# EAGLE design back (EAGLE 6.5.0)
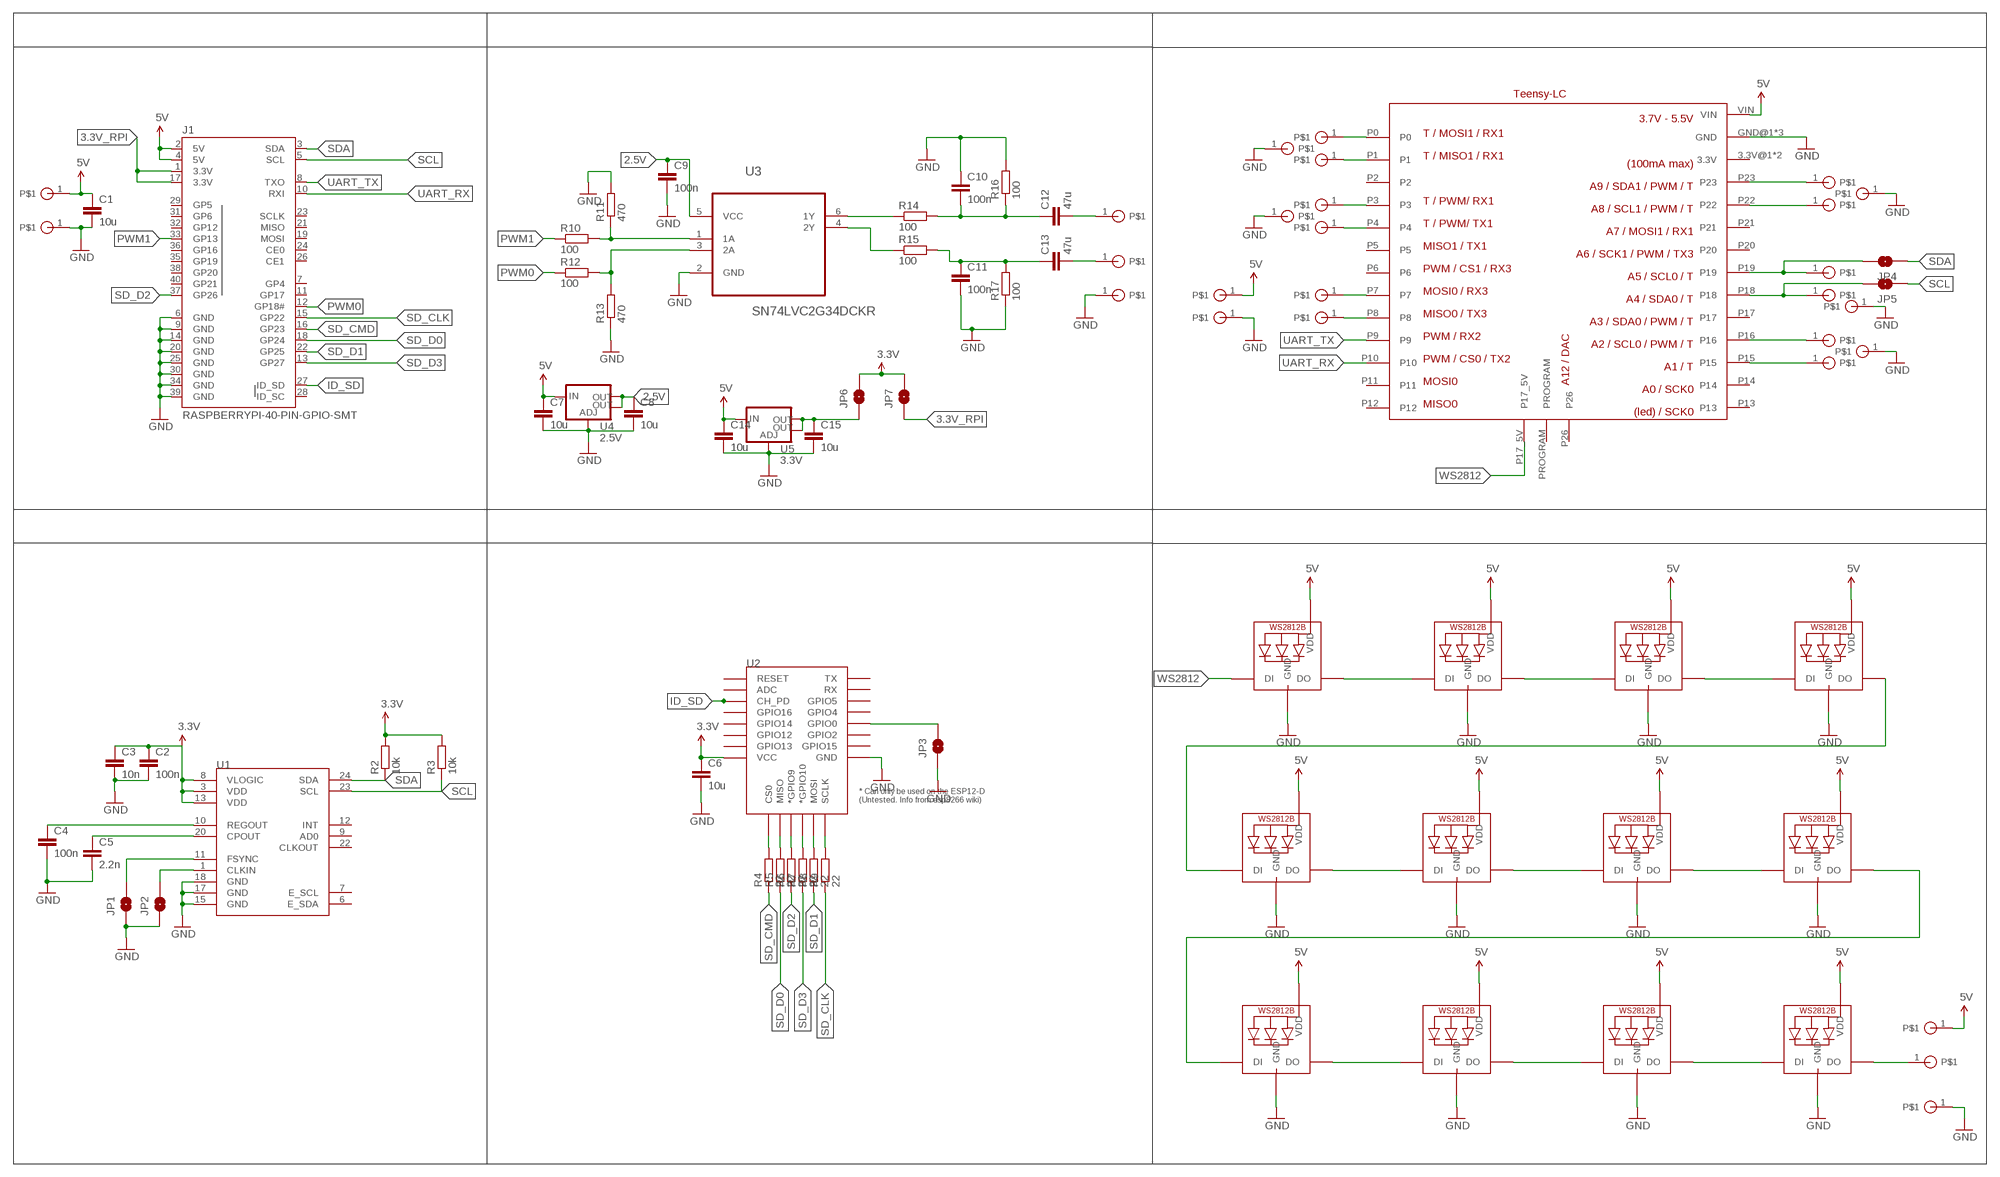
[diagram p0: schematic, sheet 1]

## Parts
5V_FRONT  SOLDER_PAD  [SOLDER_PAD]
5V_POWER  SOLDER_PAD  [SOLDER_PAD]
5V_WS1282  SOLDER_PAD  [SOLDER_PAD]
AUDIO_GND  SOLDER_PAD  [SOLDER_PAD]
AUDIO_L  SOLDER_PAD  [SOLDER_PAD]
AUDIO_R  SOLDER_PAD  [SOLDER_PAD]
C1  10u  C-EUC0805  [C0805]
C2  100n  C-EUC0603  [C0603]
C3  10n  C-EUC0603  [C0603]
C4  100n  C-EUC0603  [C0603]
C5  2.2n  C-EUC0603  [C0603]
C6  10u  C-EUC0805  [C0805]
C7  10u  C-EUC0805  [C0805]
C8  10u  C-EUC0805  [C0805]
C9  100n  C-EUC0603  [C0603]
C10  100n  C-EUC0603  [C0603]
C11  100n  C-EUC0603  [C0603]
C12  47u  C-EUC0805  [C0805]
C13  47u  C-EUC0805  [C0805]
C14  10u  C-EUC0805  [C0805]
C15  10u  C-EUC0805  [C0805]
DO_WS1282  SOLDER_PAD  [SOLDER_PAD]
GND_FRONT  SOLDER_PAD  [SOLDER_PAD]
GND_POWER  SOLDER_PAD  [SOLDER_PAD]
GND_T1_T2  SOLDER_PAD  [SOLDER_PAD]
GND_T3_T4  SOLDER_PAD  [SOLDER_PAD]
GND_T5_T6  SOLDER_PAD  [SOLDER_PAD]
GND_T7_T8  SOLDER_PAD  [SOLDER_PAD]
GND_T_SPARE  SOLDER_PAD  [SOLDER_PAD]
GND_WS2812  SOLDER_PAD  [SOLDER_PAD]
J1  RASPBERRYPI-40-PIN-GPIO-SMT  [2X20-SHROUDED-SMT]
JP1  JUMPER-PAD-2-NOYES_SILK  [PAD-JUMPER-2-NO_YES_SILK]
JP2  JUMPER-PAD-2-NOYES_SILK  [PAD-JUMPER-2-NO_YES_SILK]
JP3  JUMPER-PAD-2-NOYES_SILK  [PAD-JUMPER-2-NO_YES_SILK]
JP4  JUMPER-PAD-2-NOYES_SILK  [PAD-JUMPER-2-NO_YES_SILK]
JP5  JUMPER-PAD-2-NOYES_SILK  [PAD-JUMPER-2-NO_YES_SILK]
JP6  JUMPER-PAD-2-NOYES_SILK  [PAD-JUMPER-2-NO_YES_SILK]
JP7  JUMPER-PAD-2-NOYES_SILK  [PAD-JUMPER-2-NO_YES_SILK]
LED1  WS2812B5050  [WS2812B]
LED2  WS2812B5050  [WS2812B]
LED3  WS2812B5050  [WS2812B]
LED4  WS2812B5050  [WS2812B]
LED5  WS2812B5050  [WS2812B]
LED6  WS2812B5050  [WS2812B]
LED7  WS2812B5050  [WS2812B]
LED8  WS2812B5050  [WS2812B]
LED9  WS2812B5050  [WS2812B]
LED10  WS2812B5050  [WS2812B]
LED11  WS2812B5050  [WS2812B]
LED12  WS2812B5050  [WS2812B]
R2  10k  R-EU_R0603  [R0603]
R3  10k  R-EU_R0603  [R0603]
R4  22  R-EU_R0603  [R0603]
R5  22  R-EU_R0603  [R0603]
R6  22  R-EU_R0603  [R0603]
R7  22  R-EU_R0603  [R0603]
R8  22  R-EU_R0603  [R0603]
R9  22  R-EU_R0603  [R0603]
R10  100  R-EU_R0603  [R0603]
R11  470  R-EU_R0603  [R0603]
R12  100  R-EU_R0603  [R0603]
R13  470  R-EU_R0603  [R0603]
R14  100  R-EU_R0603  [R0603]
R15  100  R-EU_R0603  [R0603]
R16  100  R-EU_R0603  [R0603]
R17  100  R-EU_R0603  [R0603]
RX3  SOLDER_PAD  [SOLDER_PAD]
SCL/TOUCH  SOLDER_PAD  [SOLDER_PAD]
SDA/TOUCH  SOLDER_PAD  [SOLDER_PAD]
TOUCH1  SOLDER_PAD  [SOLDER_PAD]
TOUCH2  SOLDER_PAD  [SOLDER_PAD]
TOUCH3  SOLDER_PAD  [SOLDER_PAD]
TOUCH4  SOLDER_PAD  [SOLDER_PAD]
TOUCH5  SOLDER_PAD  [SOLDER_PAD]
TOUCH6  SOLDER_PAD  [SOLDER_PAD]
TOUCH7  SOLDER_PAD  [SOLDER_PAD]
TOUCH8  SOLDER_PAD  [SOLDER_PAD]
TX3  SOLDER_PAD  [SOLDER_PAD]
U1  MPU-9150QFN-24-NP  [QFN-24-NP]
U2  ESP12ESMD  [ESP12E-SMD]
U3  SN74LVC2G34DCKR  [SOT65P210X110-6N]
U4  2.5V  V_REG_LM1117SOT223  [SOT223]
U5  3.3V  V_REG_LM1117SOT223  [SOT223]
U$4  TEENSY_LCSMD  [TEENSY_LC_SMD]

## Nets
2.5V: C8.1 C9.1 U3.5(VCC) U4.2(OUT) U4.4(OUT)
3.3V: C2.1 C3.1 C6.1 JP6.2 JP7.2 R2.2 R3.2 U1.3(VDD) U1.8(VLOGIC) U1.13(VDD) U2.VCC
3.3V_RPI: J1.1(3.3V) J1.17(3.3V) JP7.1
5V: 5V_FRONT.1 5V_POWER.1 5V_WS1282.1 C1.1 C7.1 C14.1 J1.2(5V) J1.4(5V) LED1.1-VDD(VDD) LED2.1-VDD(VDD) LED3.1-VDD(VDD) LED4.1-VDD(VDD) LED5.1-VDD(VDD) LED6.1-VDD(VDD) LED7.1-VDD(VDD) LED8.1-VDD(VDD) LED9.1-VDD(VDD) LED10.1-VDD(VDD) LED11.1-VDD(VDD) LED12.1-VDD(VDD) U4.3(IN) U5.3(IN) U$4.VIN
GND: AUDIO_GND.1 C1.2 C2.2 C3.2 C4.2 C5.2 C6.2 C7.2 C8.2 C9.2 C10.1 C11.2 C14.2 C15.2 GND_FRONT.1 GND_POWER.1 GND_T1_T2.1 GND_T3_T4.1 GND_T5_T6.1 GND_T7_T8.1 GND_T_SPARE.1 GND_WS2812.1 J1.6(GND) J1.9(GND) J1.14(GND) J1.20(GND) J1.25(GND) J1.30(GND) J1.34(GND) J1.39(GND) JP1.1 JP2.1 JP3.1 LED1.3-GND(GND) LED2.3-GND(GND) LED3.3-GND(GND) LED4.3-GND(GND) LED5.3-GND(GND) LED6.3-GND(GND) LED7.3-GND(GND) LED8.3-GND(GND) LED9.3-GND(GND) LED10.3-GND(GND) LED11.3-GND(GND) LED12.3-GND(GND) R11.2 R13.1 R16.2 R17.1 U1.15(GND) U1.17(GND) U1.18(GND) U2.GND U3.2(GND) U4.1(ADJ) U5.1(ADJ) U$4.GND@1(GND) U$4.GND@2(GND) U$4.GND@3(GND)
ID_SD: J1.27(ID_SD) U2.CH_PD
N$1: JP2.2 U1.1(CLKIN)
N$2: JP1.2 U1.11(FSYNC)
N$3: C5.1 U1.20(CPOUT)
N$4: C4.1 U1.10(REGOUT)
N$5: R14.1 U3.6(1Y)
N$6: R4.2 U2.CS0
N$7: R5.2 U2.MISO
N$8: R6.2 U2.GPIO9(*GPIO9)
N$9: R7.2 U2.GPIO10(*GPIO10)
N$10: R8.2 U2.MOSI
N$11: R9.2 U2.SCLK
N$12: JP3.2 U2.GPIO0
N$13: R10.2 R11.1 U3.1(1A)
N$14: R12.2 R13.2 U3.3(2A)
N$15: R15.1 U3.4(2Y)
N$16: C10.2 C12.1 R14.2 R16.1
N$17: C11.1 C13.1 R15.2 R17.2
N$18: LED1.2-DOUT(DO) LED2.4-DIN(DI)
N$19: AUDIO_L.1 C12.2
N$20: AUDIO_R.1 C13.2
N$21: TOUCH1.1 U$4.P0
N$22: TOUCH2.1 U$4.P1
N$23: TOUCH3.1 U$4.P3
N$24: TOUCH4.1 U$4.P4
N$25: TOUCH5.1 U$4.P23
N$26: TOUCH6.1 U$4.P22
N$27: JP4.2 SDA/TOUCH.1 U$4.P19
N$28: JP5.2 SCL/TOUCH.1 U$4.P18
N$29: TOUCH7.1 U$4.P16
N$30: TOUCH8.1 U$4.P15
N$31: RX3.1 U$4.P7
N$32: TX3.1 U$4.P8
N$33: LED2.2-DOUT(DO) LED3.4-DIN(DI)
N$34: LED3.2-DOUT(DO) LED4.4-DIN(DI)
N$35: LED4.2-DOUT(DO) LED5.4-DIN(DI)
N$36: LED5.2-DOUT(DO) LED6.4-DIN(DI)
N$37: LED6.2-DOUT(DO) LED7.4-DIN(DI)
N$38: LED7.2-DOUT(DO) LED8.4-DIN(DI)
N$39: LED8.2-DOUT(DO) LED9.4-DIN(DI)
N$40: LED9.2-DOUT(DO) LED10.4-DIN(DI)
N$41: LED10.2-DOUT(DO) LED11.4-DIN(DI)
N$42: LED11.2-DOUT(DO) LED12.4-DIN(DI)
N$43: DO_WS1282.1 LED12.2-DOUT(DO)
N$44: C15.1 JP6.1 U5.2(OUT) U5.4(OUT)
PWM0: J1.12(GP18#) R12.1
PWM1: J1.33(GP13) R10.1
SCL: J1.5(SCL) JP5.1 R3.1 U1.23(SCL)
SD_CLK: J1.15(GP22) R9.1
SD_CMD: J1.16(GP23) R4.1
SD_D0: J1.18(GP24) R5.1
SD_D1: J1.22(GP25) R8.1
SD_D2: J1.37(GP26) R6.1
SD_D3: J1.13(GP27) R7.1
SDA: J1.3(SDA) JP4.1 R2.1 U1.24(SDA)
UART_RX: J1.10(RXI) U$4.P10
UART_TX: J1.8(TXO) U$4.P9
WS2812: LED1.4-DIN(DI) U$4.P17_5V
Unconnected: J1.7(GP4) J1.11(GP17) J1.19(MOSI) J1.21(MISO) J1.23(SCLK) J1.24(CE0) J1.26(CE1) J1.28(ID_SC) J1.29(GP5) J1.31(GP6) J1.32(GP12) J1.35(GP19) J1.36(GP16) J1.38(GP20) J1.40(GP21) U1.6(E_SDA) U1.7(E_SCL) U1.9(AD0) U1.12(INT) U1.22(CLKOUT) U2.ADC U2.GPIO2 U2.GPIO4 U2.GPIO5 U2.GPIO12 U2.GPIO13 U2.GPIO14 U2.GPIO15 U2.GPIO16 U2.RESET U2.RXD0(RX) U2.TXD0(TX) U$4.3.3V@1(3.3V) U$4.3.3V@2(3.3V) U$4.P2 U$4.P5 U$4.P6 U$4.P11 U$4.P12 U$4.P13 U$4.P14 U$4.P17 U$4.P20 U$4.P21 U$4.P26 U$4.PROGRAM

## Library data of the parts
5V_FRONT 5V_POWER 5V_WS1282 AUDIO_GND AUDIO_L AUDIO_R DO_WS1282 GND_FRONT GND_POWER GND_T1_T2 GND_T3_T4 GND_T5_T6 GND_T7_T8 GND_T_SPARE GND_WS2812 RX3 SCL/TOUCH SDA/TOUCH TOUCH1-TOUCH8 TX3 = timearc:SOLDER_PAD
C1-C15 = timearc:C-EU: CAPACITOR, European symbol
J1 = SparkFun-Boards:RASPBERRYPI-40-PIN-GPIO: Second Generation Raspberry Pi GPIO Header 2x20 pin connector, as found on B, B+, A+ models.; PROD_ID: CONN-13143
JP1-JP7 = SparkFun-Passives:JUMPER-PAD-2-NO
LED1-LED12 = timearc:WS2812B
R2-R17 = timearc:R-EU_: RESISTOR, European symbol
U1 = timearc:MPU-9150: 9DOF (3mag, 3accel, 3rotat). I2C interface.
U2 = timearc:ESP12E: ESP12E Module
U3 = timearc:SN74LVC2G34DCKR: DUAL BUFFER GATE; MPN: SN74LVC2G34DCKR; OC_FARNELL: 1595409; OC_NEWARK: 76C4214; PACKAGE: SC70-6; SUPPLIER: Texas Instruments
U4 U5 = SparkFun-PowerIC:V_REG_LM1117: Voltage Regulator LM1117 Standard adjustable voltage regulator but in SMD form. Spark Fun Electronics SKU : COM-00595; PROD_ID: VREG-08170
U$4 = timearc:TEENSY_LC: Teensy LC

## Board
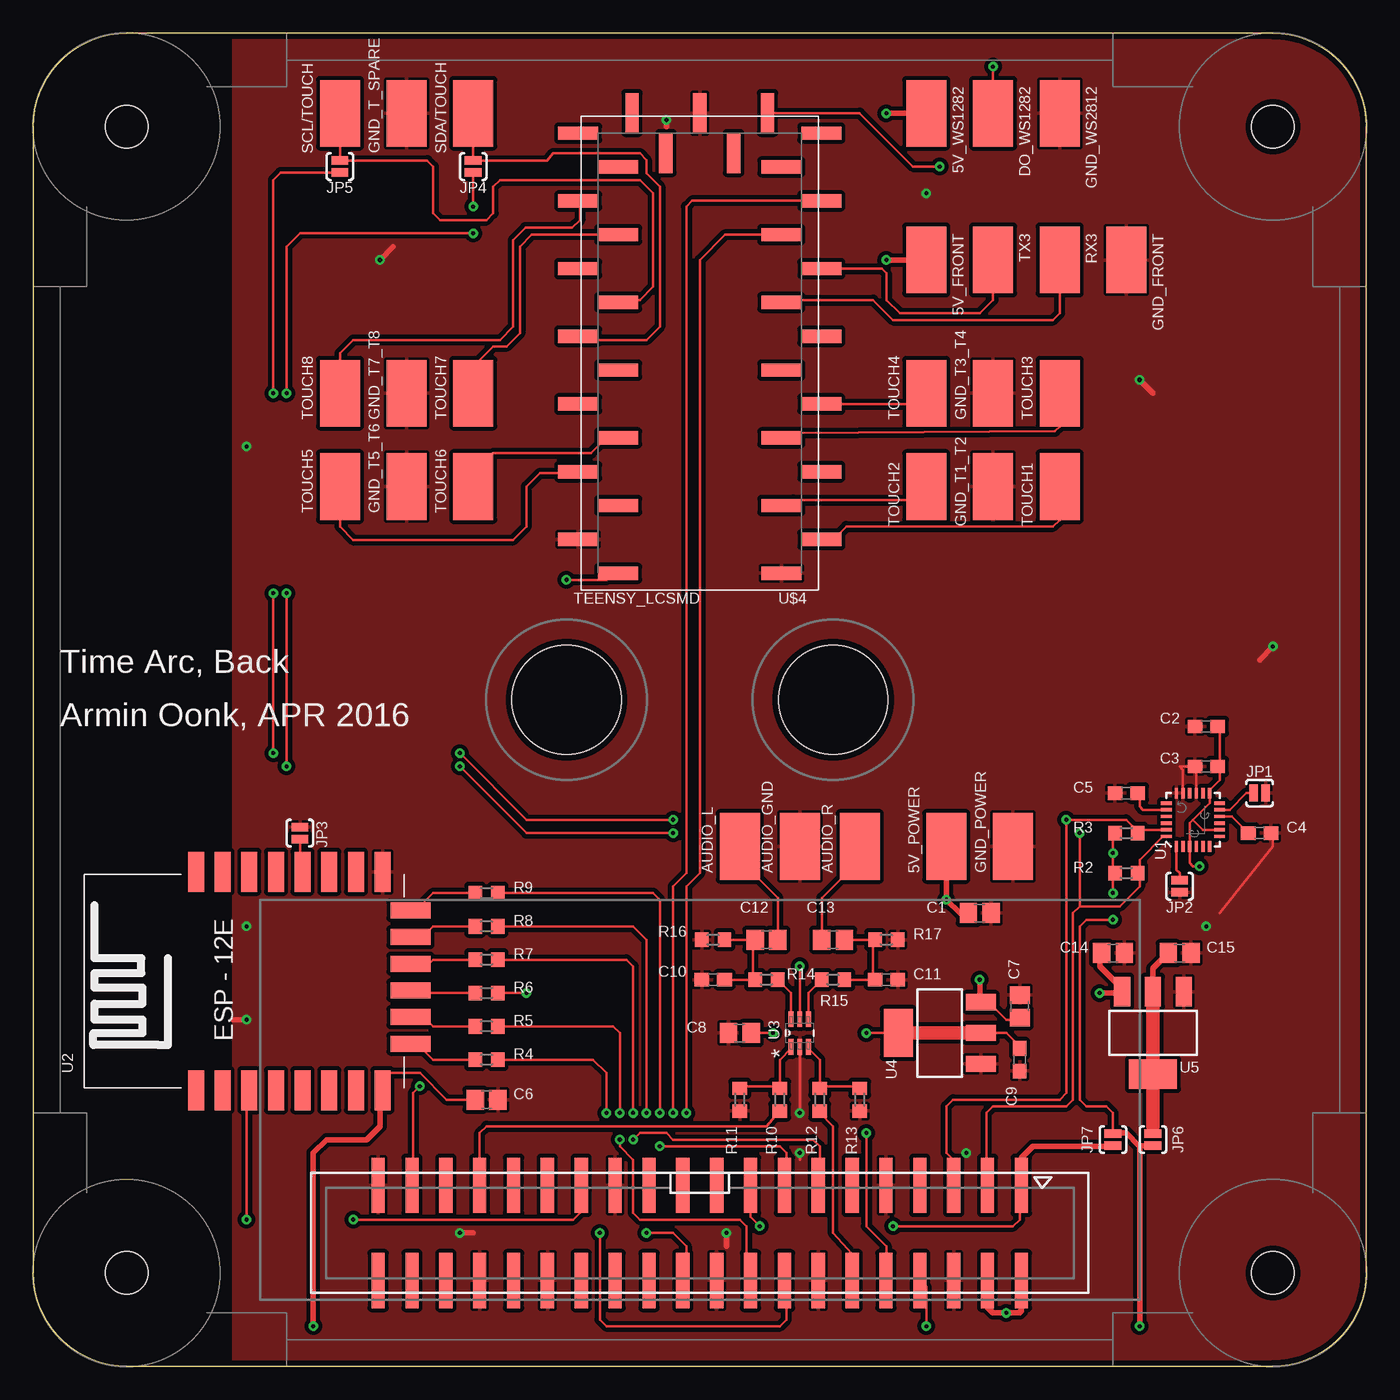
[diagram p1: board, top side]
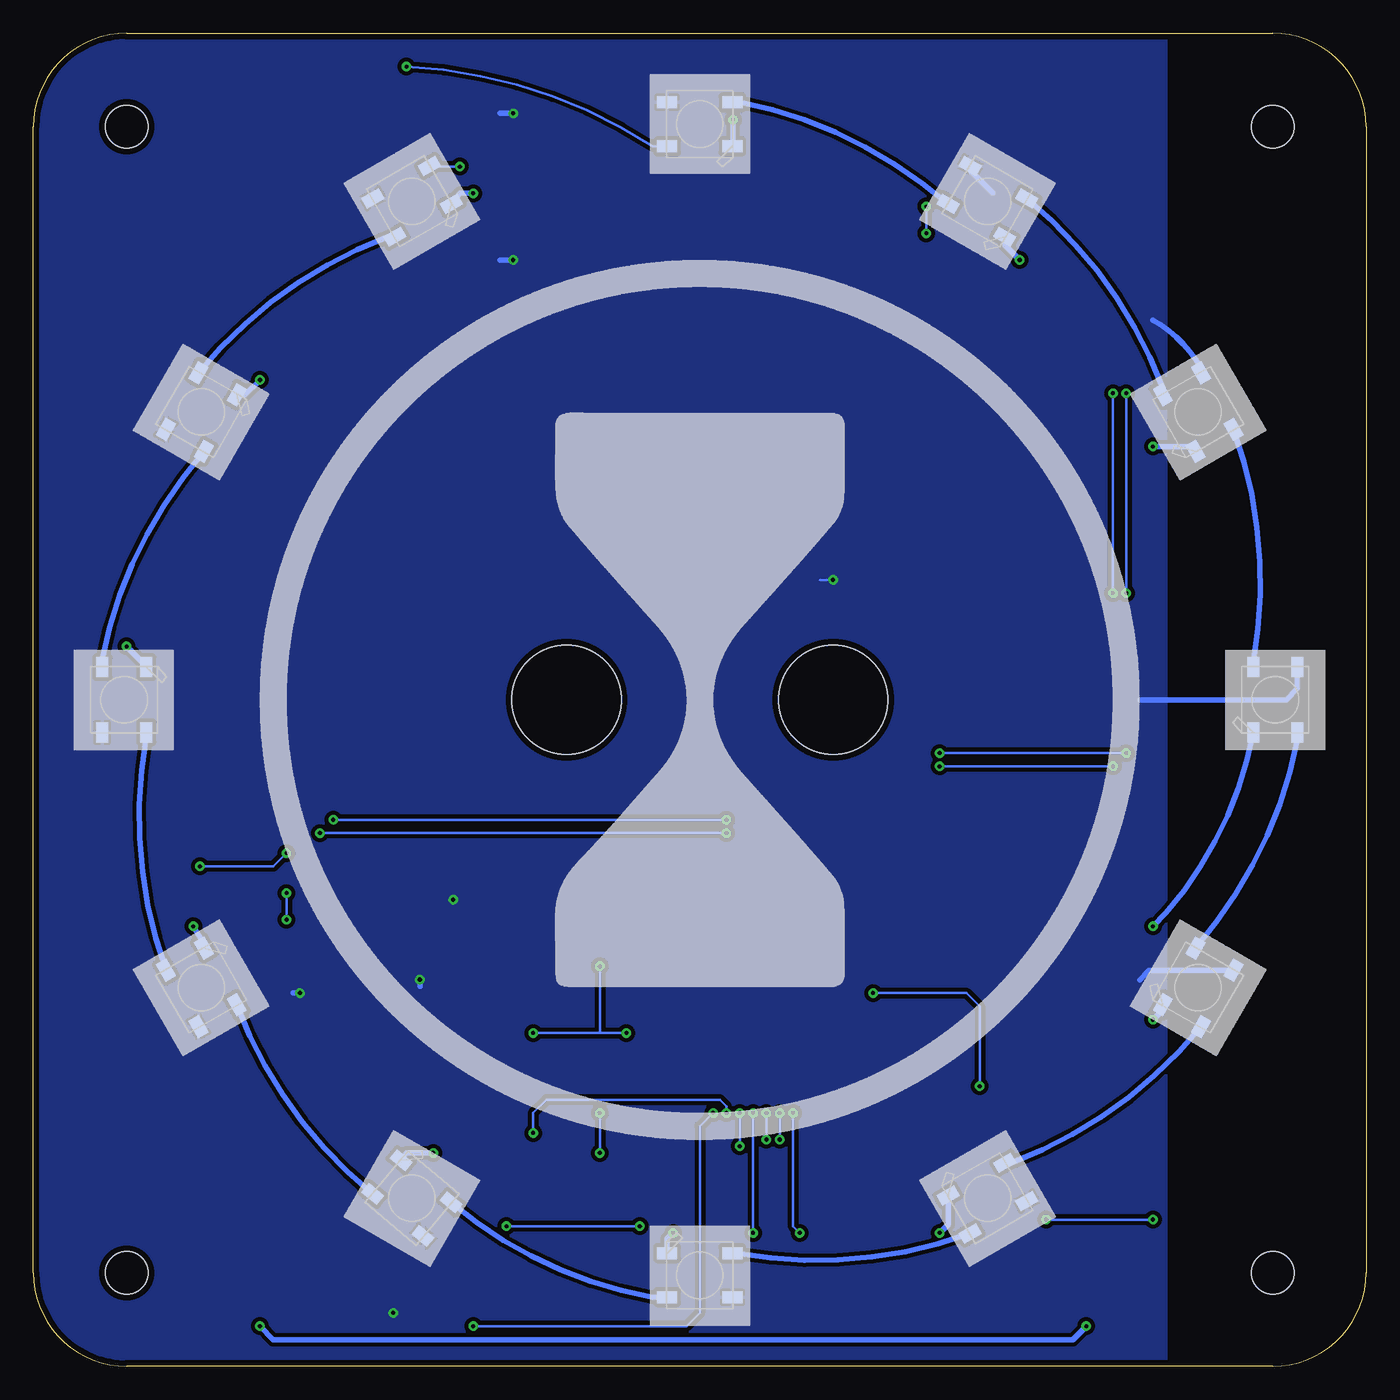
[diagram p2: board, bottom side, seen from below]

Size 100 x 100 mm. Coordinates in mm from the lower left corner, seen from the top.
Outline: 7,0 93,0 arc90 100,7 100,93 arc90 93,100 7,100 arc90 0,93 0,7 arc90 7,0
Copper layers (1*16): Top 0.018mm / dielectric 1.55mm / Bottom 0.018mm
Design rules "eC-PCB_proto-2-layer *": minimum track width 0.15mm, minimum drill 0.25mm, track to track 0.15mm, track to pad 0.15mm, pad to pad 0.15mm, via to via 0.15mm, smd to smd 0.15mm, copper to edge 0.45mm, drill to drill 0.3mm, minimum pad ring 0.2mm, minimum via ring 0.2mm, stop-mask expansion 0.1mm, vias tented up to drill 0.35mm, thermal gap 0.2mm
Holes 8.2 mm at 40,50 60,50

### Footprints (pad centres in the part's own frame; a part is rotated, then mirrored left to right if it is on the bottom)
SOLDER_PAD = smd 3 x 5: 1 0,0
C0805 = smd 1.3 x 1.5: 1 -0.85,0; 2 0.85,0
C0603 = smd 1.1 x 1: 1 -0.85,0; 2 0.85,0
2X20-SHROUDED-SMT = smd 4.14 x 0.991: 1 -3.569,24.13; 2 3.569,24.13; 3 -3.569,21.59; 4 3.569,21.59; 5 -3.569,19.05; 6 3.569,19.05; 7 -3.569,16.51; 8 3.569,16.51; 9 -3.569,13.97; 10 3.569,13.97; 11 -3.569,11.43; 12 3.569,11.43; 13 -3.569,8.89; 14 3.569,8.89; 15 -3.569,6.35; 16 3.569,6.35; 17 -3.569,3.81; 18 3.569,3.81; 19 -3.569,1.27; 20 3.569,1.27; 21 -3.569,-1.27; 22 3.569,-1.27; 23 -3.569,-3.81; 24 3.569,-3.81; 25 -3.569,-6.35; 26 3.569,-6.35; 27 -3.569,-8.89; 28 3.569,-8.89; 29 -3.569,-11.43; 30 3.569,-11.43; 31 -3.569,-13.97; 32 3.569,-13.97; 33 -3.569,-16.51; 34 3.569,-16.51; 35 -3.569,-19.05; 36 3.569,-19.05; 37 -3.569,-21.59; 38 3.569,-21.59; 39 -3.569,-24.13; 40 3.569,-24.13
PAD-JUMPER-2-NO_YES_SILK = smd 0.635 x 1.27: 1 -0.45,0; 2 0.45,0
WS2812B = smd 1.5 x 0.9: 1-VDD 2.45,-1.65; 2-DOUT 2.45,1.65; 3-GND -2.45,1.65; 4-DIN -2.45,-1.65
R0603 = smd 1 x 1.1: 1 -0.85,0; 2 0.85,0
QFN-24-NP = smd 0.8 x 0.25: 1 -2,1.25; 2 -2,0.75; 3 -2,0.25; 4 -2,-0.25; 5 -2,-0.75; 6 -2,-1.25; 13 2,-1.25; 14 2,-0.75; 15 2,-0.25; 16 2,0.25; 17 2,0.75; 18 2,1.25 | smd 0.25 x 0.8: 7 -1.25,-2; 8 -0.75,-2; 9 -0.25,-2; 10 0.25,-2; 11 0.75,-2; 12 1.25,-2; 19 1.25,2; 20 0.75,2; 21 0.25,2; 22 -0.25,2; 23 -0.75,2; 24 -1.25,2
ESP12E-SMD = smd 3 x 1.2: ADC -8.3,3.8; CH_PD -8.3,1.8; GND 8.1,-8.2; GPIO0 8.1,-2.2; GPIO2 8.1,-4.2; GPIO4 8.1,-0.2; GPIO5 8.1,1.8; GPIO12 -8.3,-4.2; GPIO13 -8.3,-6.2; GPIO14 -8.3,-2.2; GPIO15 8.1,-6.2; GPIO16 -8.3,-0.2; RESET -8.3,5.8; RXD0 8.1,3.8; TXD0 8.1,5.8; VCC -8.3,-8.2 | smd 1.2 x 3: CS0 -4.8,-10.3; GPIO9 -0.8,-10.3; GPIO10 1.2,-10.3; MISO -2.8,-10.3; MOSI 3.2,-10.3; SCLK 5.2,-10.3
SOT65P210X110-6N = smd 1.168 x 0.356: 1 -1.041,0.66; 2 -1.041,0; 3 -1.041,-0.66; 4 1.041,-0.66; 5 1.041,0; 6 1.041,0.66
SOT223 = smd 1.219 x 2.235: 1 -2.311,-3.099; 2 0,-3.099; 3 2.311,-3.099 | smd 3.6 x 2.2: 4 0,3.099
TEENSY_LC_SMD = smd 1 x 3: 3.3V@1 -2.54,-15.011; GND@2 0,-18.011; P17_5V -5.08,-18.011; P26 5.08,-18.011; PROGRAM 2.54,-15.011 | smd 3 x 1: 3.3V@2 6.121,11.43; GND@1 -6.121,16.51; GND@3 9.121,13.97; P0 -9.121,13.97; P1 -6.121,11.43; P2 -9.121,8.89; P3 -6.121,6.35; P4 -9.121,3.81; P5 -6.121,1.27; P6 -9.121,-1.27; P7 -6.121,-3.81; P8 -9.121,-6.35; P9 -6.121,-8.89; P10 -9.121,-11.43; P11 -6.121,-13.97; P12 -9.121,-16.51; P13 9.121,-16.51; P14 6.121,-13.97; P15 9.121,-11.43; P16 6.121,-8.89; P17 9.121,-6.35; P18 6.121,-3.81; P19 9.121,-1.27; P20 6.121,1.27; P21 9.121,3.81; P22 6.121,6.35; P23 9.121,8.89; VIN 6.121,16.51
TIMEARC_KEEPOUT = hole 3.2: 7,93; 93,93; 93,7; 7,7

### Placement (x,y rotation side)
5V_FRONT  67,83 180 top
5V_POWER  68.5,39 0 top
5V_WS1282  67,94 180 top
AUDIO_GND  57.5,39 0 top
AUDIO_L  53,39 0 top
AUDIO_R  62,39 0 top
C1  71,34 0 top
C2  88,48 180 top
C3  88,45 180 top
C4  92,40 0 top
C5  82,43 180 top
C6  34,20 0 top
C7  74,27 90 top
C8  53,25 180 top
C9  74,23 270 top
C10  51,29 0 top
C11  64,29 0 top
C12  55,32 0 top
C13  60,32 180 top
C14  81,31 0 top
C15  86,31 0 top
DO_WS1282  72,94 180 top
GND_FRONT  82,83 180 top
GND_POWER  73.5,39 0 top
GND_T1_T2  72,66 0 top
GND_T3_T4  72,73 0 top
GND_T5_T6  28,66 0 top
GND_T7_T8  28,73 0 top
GND_T_SPARE  28,94 0 top
GND_WS2812  77,94 180 top
J1  50,10 270 top
JP1  92,43 180 top
JP2  86,36 90 top
JP3  20,40 270 top
JP4  33,90 90 top
JP5  23,90 90 top
JP6  84,17 270 top
JP7  81,17 90 top
LED1  71.59,87.39 210 bottom
LED2  87.39,71.59 240 bottom
LED3  93.18,50 270 bottom
LED4  87.39,28.41 300 bottom
LED5  71.59,12.6 320 bottom
LED6  50,6.82 0 bottom
LED7  28.41,12.6 30 bottom
LED8  12.6,28.41 60 bottom
LED9  6.82,50 90 bottom
LED10  12.6,71.59 120 bottom
LED11  28.41,87.39 150 bottom
LED12  50,93.18 180 bottom
R2  82,37 180 top
R3  82,40 180 top
R4  34,23 180 top
R5  34,25.5 180 top
R6  34,28 180 top
R7  34,30.5 180 top
R8  34,33 180 top
R9  34,35.5 180 top
R10  56,20 90 top
R11  53,20 270 top
R12  59,20 90 top
R13  62,20 90 top
R14  55,29 180 top
R15  60,29 0 top
R16  51,32 180 top
R17  64,32 180 top
RX3  77,83 180 top
SCL/TOUCH  23,94 0 top
SDA/TOUCH  33,94 0 top
TOUCH1  77,66 0 top
TOUCH2  67,66 0 top
TOUCH3  77,73 0 top
TOUCH4  67,73 0 top
TOUCH5  23,66 0 top
TOUCH6  33,66 0 top
TOUCH7  33,73 0 top
TOUCH8  23,73 0 top
TX3  72,83 180 top
U1  87,41 90 top
U2  18,29 90 top
U3  57.5,25 90 top
U4  68,25 90 top
U5  84,25 180 top
U$1  [TIMEARC_LOGO]  100,0 0 bottom
U$4  50,76 180 top
U$15  [TIMEARC_KEEPOUT]  0,0 0 top

### Tracks (layer width: path | path; a pad name or v marks a point on that pad's centre or on a via)
2.5V  (via drill 0.31)
  Top 0.203: U4.2 73,25 74,24 C9.1 | U4.4 v62.5,25 | v55.5,25 C8.1 | U3.5 v57.5,30
  Top 1.016: U4.2 U4.4
  Bottom 0.203: v62.5,25 57.5,25 | 57.5,25 v55.5,25 | v57.5,30 57.5,25
3.3V  (via drill 0.31)
  Top 0.203: C2.1 89,47.85 89,45 C3.1 89,44.85 89,44 88.25,43.25 U1.13 88.25,42.25 87,41 | 87,41 86.75,40.75 U1.3 86.75,37.75 87,37.5 v87.5,37.5 | U1.8 87.75,40.25 87,41 | 26.3,21.8 26.5,22 29,22 31,20 33,20 33,20.15 C6.1 | v81,35.5 81,37 R2.2 81,37.15 v81,38.5 81,40 R3.2 | v81,33.5 79,33.5 78.5,33 78.5,20 79,19.5 80.5,19.5 81,19 JP7.2
  Top 0.406: JP6.2 82.95,16.55 | 82.95,16.55 82,17.5 81.05,17.5 JP7.2 | v21,3 21,16 22,17 25,17 26,18 26,19.5 26.2,19.7 U2.VCC 26.2,21.7 26.3,21.8 | v83,3 83,16.5 82.95,16.55
  Bottom 0.203: v81,35.5 v81,33.5 | v81,38.5 82,37.5 v87.5,37.5
  Bottom 0.406: v21,3 22,2 82,2 v83,3
3.3V_RPI  (via drill 0.31)
  Top 0.203: J1.17 53.81,11.19 v54.5,10.5 | v64.5,10.5 73.5,10.5 74,11 74,13.44 J1.1
  Top 0.406: J1.1 74.13,15.63 75,16.5 80.95,16.5 JP7.1
  Bottom 0.203: v54.5,10.5 v64.5,10.5
5V  (via drill 0.31)
  Top 0.203: U4.3 71.69,27.31 73,26 73.85,26 C7.1 | U$4.VIN 43.49,59.49 43,59 v40,59
  Top 0.406: U4.3 71.1,27.4 71,27.5 v71,29 | C1.1 69.5,34 v68.5,35 5V_POWER.1 | J1.2 74.13,4.13 74,4.13 74,4 v73,4 72,4 71.59,4.41 J1.4 | 5V_WS1282.1 v64,94 | 5V_FRONT.1 v64,83 | C14.1 80,31 80,30 81.5,28.5 81.5,28.29 U5.3 81.6,28.1 81.5,28 v80,28
  Bottom 0.203: LED10.1-VDD 12.4,74.9 | v40,59 41,59
  Bottom 0.406: v71,29 71,28.5 | LED11.1-VDD 29.71,89.71 28,88 | LED8.1-VDD 16.29,29.71 17,29 | LED9.1-VDD 5.17,50.83 6,50 17,50 | 12.4,74.9 arc-30 16,78.5 | v64,94 65,94 | v64,83 65,83 | v80,28 80.5,28
  pour Bottom (isolate 0.305): 15,0 100,0 100,100 15,100
GND  (via drill 0.31)
  Top 0.203: U3.2 v57.5,19 | 89,34 93,39 93,39.85 C4.2 | U1.15 87.25,44.9 C3.2 86,45 86.25,44.75 U1.17 | v57.5,16 57.5,15.5
  Top 0.406: v93,54 92,53 | v83,74 84,73 | v26,83 27,84 | v32,10 33,10 | v52,10 52,9 | v16,26 15,26 | v47.5,93.5 47.5,93
  Bottom 0.203: v57.5,19 v57.5,16
  Bottom 0.406: LED4.3-GND 87.19,31.69 v88,33 | LED3.3-GND 91.53,52.53 v93,54 | LED2.3-GND 84.11,72.89 v83,74 | LED11.3-GND 27.11,84.11 v26,83 | LED10.3-GND 12.81,68.19 13,69 v16,69 | LED7.3-GND 31.36,10.64 v32,10 | LED5.3-GND 72.44,15.44 72,16 v70,16 | v67,88 68,88 69,86.83 LED1.3-GND | LED6.3-GND 52.45,9.55 v52,10 | LED8.3-GND 15.26,26.74 v16,26 | LED12.3-GND 47.55,91.95 47.5,92 v47.5,93.5 | LED9.3-GND arc30 15.02,34 v16,33
  pour Top (isolate 0.305): 15,0 100,0 100,100 15,100
ID_SD  (via drill 0.31)
  Top 0.203: J1.27 41,13.46 41,11.5 40.5,11 v24,11 | 16.2,20.2 16,20 v16,11
  Top 0.406: 16.2,20.2 U2.CH_PD
  Bottom 0.203: v16,11 v24,11
N$1
  Top 0.203: U1.1 85.75,37.25 86,37 JP2.2
N$2
  Top 0.203: U1.11 89.75,41.75 91,43 JP1.2
N$3
  Top 0.203: U1.20 83.25,41.75 83,42 83,42.85 C5.1
N$4
  Top 0.203: U1.10 89.9,41.25 C4.1
N$5
  Top 0.203: U3.6 56.84,28.01 R14.1
N$6
  Top 0.203: U2.CS0 28.8,24.2 30,23 R4.2
N$7
  Top 0.203: U2.MISO 29.3,26.2 30,25.5 R5.2
N$8
  Top 0.203: U2.GPIO9 28.8,28.2 29,28 R6.2
N$9
  Top 0.203: U2.GPIO10 29.7,30.2 30,30.5 R7.2
N$10
  Top 0.203: U2.MOSI 29.2,32.2 30,33 R8.2
N$11
  Top 0.203: U2.SCLK 28.7,34.2 30,35.5 R9.2
N$12
  Top 0.203: JP3.2 20,37.3 U2.GPIO0
N$13
  Top 0.203: U3.1 56.84,23.84 56,23 R10.2 | 56,21 R10.2 | R11.1 53,21 55.85,21 R10.2
N$14
  Top 0.203: U3.3 58.16,23.84 59,23 R12.2 | 59,21 R12.2 | R13.2 62,21 59.15,21 R12.2
N$15
  Top 0.203: U3.4 58.16,28.01 R15.1
N$16
  Top 0.203: 54,29 C10.2 | R14.2 54,29 | 54,29 54,31.85 C12.1 R16.1
N$17
  Top 0.203: R15.2 63,29 | C11.1 63,29 | 63,29 63,31.85 R17.2 C13.1
N$18
  Bottom 0.406: LED2.4-DIN arc30 73.39,84.74 LED1.2-DOUT
N$19
  Top 0.203: C12.2 55.85,35.15 53,38 AUDIO_L.1
N$20
  Top 0.203: C13.2 59.15,35.15 62,38 AUDIO_R.1
N$21
  Top 0.203: U$4.P0 60.03,62.03 61,63 76.5,63 77,63.5 TOUCH1.1
N$22
  Top 0.203: U$4.P1 56.57,64.57 57,65 66,65 TOUCH2.1
N$23
  Top 0.203: U$4.P3 56.65,69.65 57,70 76.65,70.15 77,70.5 TOUCH3.1
N$24
  Top 0.203: U$4.P4 66.19,72.19 TOUCH4.1
N$25
  Top 0.203: TOUCH5.1 23,63 24,62 36,62 37,63 37,66 38,67 40.77,67 U$4.P23
N$26
  Top 0.203: U$4.P22 43,69.65 | 43,69.65 42.65,69.65 | TOUCH6.1 33,67 34.5,68.5 41.85,68.5 43,69.65
N$27
  Top 0.203: SDA/TOUCH.1 JP4.2 38.55,90.45 39,91 45.5,91 46,90.5 46,89.5 47,88.5 47,78 46,77 41.15,77 U$4.P19
N$28
  Top 0.203: SCL/TOUCH.1 JP5.2 29.55,90.45 30,90 30,86.5 30.5,86 34,86 34.5,86.5 34.5,88.5 35,89 45.5,89 46.5,88 46.5,81 45.5,80 44.07,80 U$4.P18
N$29
  Top 0.203: U$4.P16 37.39,84.89 36.5,84 36.5,77.5 35.5,76.5 34.5,76.5 33,75 TOUCH7.1
N$30
  Top 0.203: U$4.P15 41,87.5 41,86 40.43,85.43 36.93,85.43 36,84.5 36,78 35,77 24,77 23,76 TOUCH8.1
N$31
  Top 0.203: U$4.P7 56.81,79.81 57,80 63,80 64.5,78.5 76.5,78.5 77,79 RX3.1
N$32
  Top 0.203: U$4.P8 63.65,82.35 64,82 64,80 65,79 71,79 72,80 TX3.1
N$33
  Bottom 0.406: LED3.4-DIN 94.83,53 arc30 LED2.2-DOUT
N$34
  Bottom 0.406: LED4.4-DIN arc30 91.53,47.19 LED3.2-DOUT
N$35
  Bottom 0.406: LED5.4-DIN arc30 84.74,27.13 LED4.2-DOUT
N$36
  Bottom 0.406: LED6.4-DIN 53.53,5.17 arc30 LED5.2-DOUT
N$37
  Bottom 0.406: LED7.4-DIN arc30 47.19,8.47 LED6.2-DOUT
N$38
  Bottom 0.406: LED8.4-DIN arc30 26.61,15.26 LED7.2-DOUT
N$39
  Bottom 0.406: LED9.4-DIN 5.17,47 arc30 LED8.2-DOUT
N$40
  Bottom 0.406: LED10.4-DIN arc30 8.47,52.81 LED9.2-DOUT
N$41
  Bottom 0.406: LED11.4-DIN arc30 15.26,73.39 LED10.2-DOUT
N$42
  Bottom 0.406: LED12.4-DIN 47,94.83 arc30 LED11.2-DOUT
N$43  (via drill 0.31)
  Top 0.203: v72,97.5 DO_WS1282.1
  Bottom 0.203: LED12.2-DOUT 53.53,91.53 arc-30 v72,97.5
N$44
  Top 0.406: U5.2 84,29.85 C15.1 | 84,18 84.05,18 JP6.1
  Top 1.016: U5.2 U5.4 84,18
PWM0
  Top 0.203: J1.12 61.43,8.43 60,10 60,18 59,19 59.15,19 R12.1
PWM1
  Top 0.203: J1.33 33.49,17.49 34,18 55,18 55.85,19 R10.1
SCL  (via drill 0.31)
  Top 0.203: U1.23 83.1,40.25 R3.1 82.85,40.15 82,41 v77.5,41 77.5,20.5 77,20 69,20 68.5,19.5 68.5,16 69.05,15.45 J1.5 | JP5.1 18.55,89.55 18,89 v18,73 | v18,58 v18,46 | v32,46 37,41 v48,41
  Bottom 0.203: v18,73 v18,58 | v18,46 v32,46 | v48,41 v77.5,41
SD_CLK  (via drill 0.31)
  Top 0.203: R9.1 46.5,35.5 47,35 v47,19 | v47,16.5 56,16.5 56.5,16 56.5,13.72 J1.15
  Bottom 0.203: v47,19 v47,16.5
SD_CMD  (via drill 0.31)
  Top 0.203: R4.1 42,23 43,22 v43,19 | v42.5,10 42.5,3.5 43,3 56,3 56.5,3.5 56.5,6.28 J1.16
  Bottom 0.203: v43,19 43,10.5 v42.5,10
SD_D0  (via drill 0.31)
  Top 0.203: R5.1 43.5,25.5 44,25 v44,19 | v44,17 44,16.5 45,15.5 45,11.5 45.5,11 53,11 53.5,10.5 53.5,6.74 J1.18
  Bottom 0.203: v44,19 v44,17
SD_D1  (via drill 0.31)
  Top 0.203: R8.1 45,33 46,32 v46,19 | v46,10 48,10 49,9 49,6.7 J1.22
  Bottom 0.203: v46,19 v46,10
SD_D2  (via drill 0.31)
  Top 0.203: R6.1 v37,28 | v29,21 28.5,20.5 28.5,13.66 J1.37
  Bottom 0.203: v37,28 30,28 29,27 v29,21
SD_D3  (via drill 0.31)
  Top 0.203: R7.1 44.5,30.5 45,30 v45,19 | v45,17 45.5,17.5 47.5,17.5 48,17 58.5,17 59,16.5 59,13.68 J1.13
  Bottom 0.203: v45,19 v45,17
SDA  (via drill 0.31)
  Top 0.203: U1.24 84.75,39.75 83,38 83,37.15 | 83,37.15 R2.1 | 83,37.15 83,36 81.5,34.5 78.5,34.5 | 78.5,34.5 78,34 78,20 77.5,19.5 72,19.5 71.5,19 71.5,13.66 J1.3 | JP4.1 v33,87 | v33,85 20,85 19,84 v19,73 | v19,58 v19,45 | v32,45 37,40 v48,40 | v78.5,40 78.5,34.5
  Bottom 0.203: v33,87 v33,85 | v19,73 v19,58 | v19,45 v32,45 | v48,40 v78.5,40
UART_RX  (via drill 0.31)
  Top 0.203: U$4.P10 49.43,87.43 49,87 49,37 48,36 v48,19 | v62.5,17.5 62.5,10.5 64,9 64,6.46 J1.10
  Bottom 0.203: v48,19 48,19.5 48.5,20 61.5,20 62.5,19 v62.5,17.5
UART_TX  (via drill 0.31)
  Top 0.203: U$4.P9 51.89,84.89 50,83 50,37 49,36 v49,19 | v67,3 67,5.94 J1.8
  Bottom 0.203: v49,19 50,18 50,4 51,3 v67,3
WS2812  (via drill 0.31)
  Top 0.203: v68,90 66,90 61.99,94.01 U$4.P17_5V
  Bottom 0.203: v68,90 70.24,90 LED1.4-DIN

### Text on the board
tPlace: Time Arc, Back | Armin Oonk, APR 2016